# Altium schematic sheet MPU.SchDoc
size A3; SheetNumber: 8; SheetTotal: 14
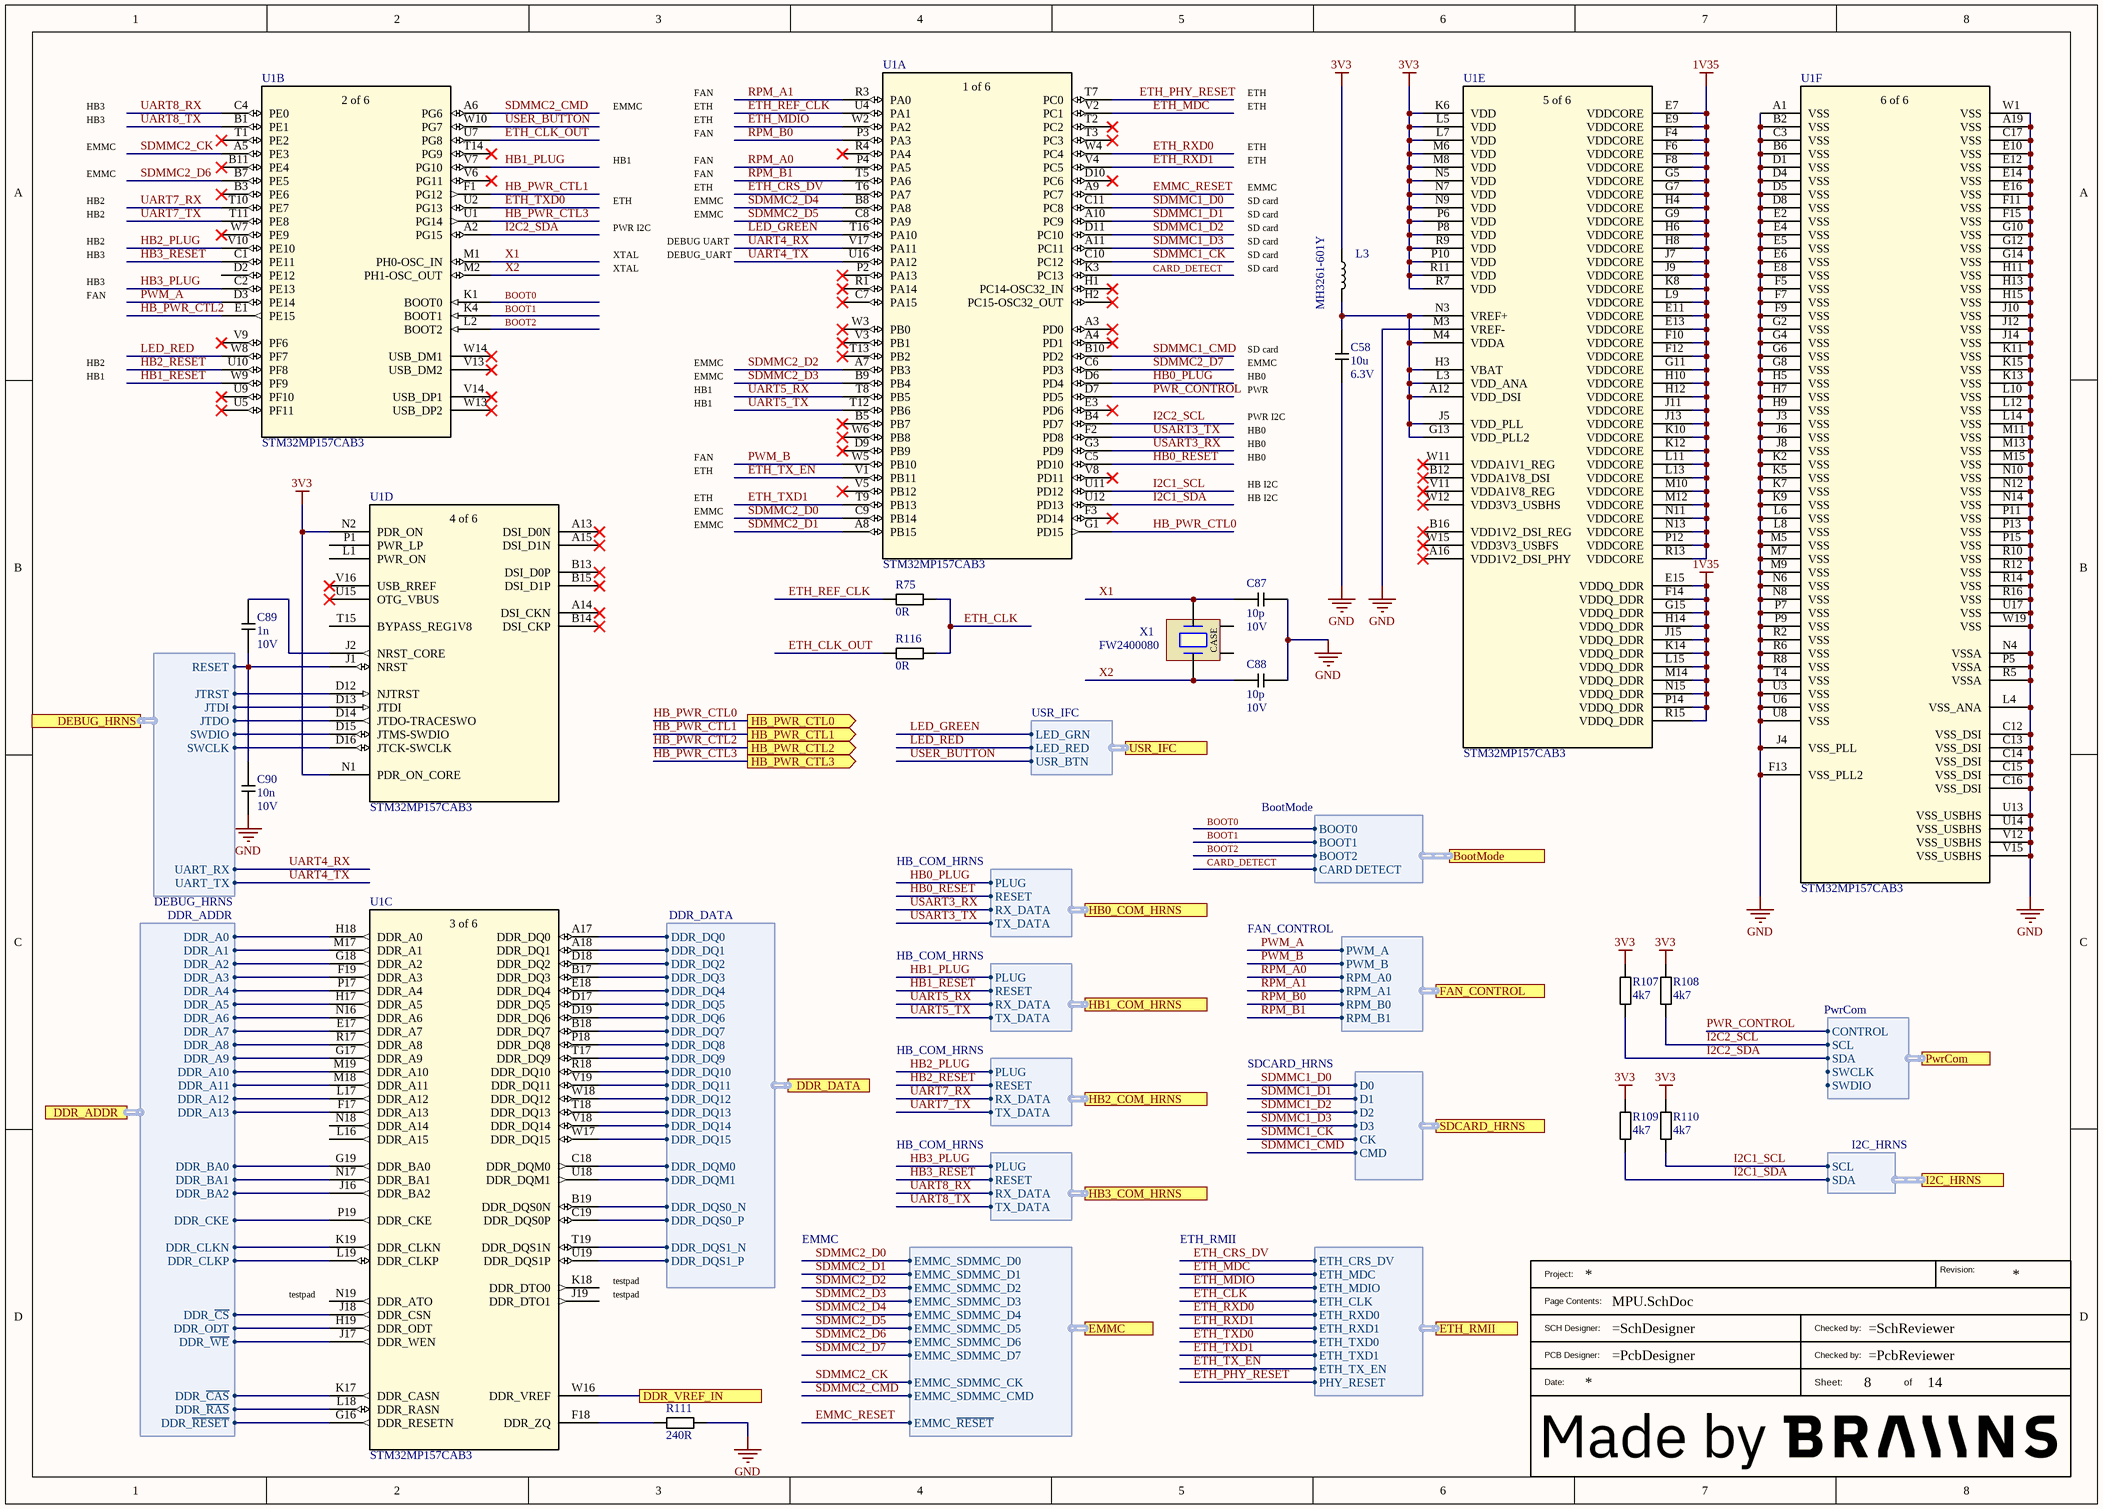
[diagram p0: MPU.SchDoc]

## Parts
?  BraiinsTitleBlockWithLogo  (value not drawn)  (graphical)
C58  Voltage_Rating: 6.3V  [CAP0603]  (hidden comment: 10u)
C87  Voltage_Rating: 10V  [CAP0402]  (hidden comment: 10p)
C88  Voltage_Rating: 10V  [CAP0402]  (hidden comment: 10p)
C89  Voltage_Rating: 10V  [CAP0402]  (hidden comment: 1n)
C90  Voltage_Rating: 10V  [CAP0402]  (hidden comment: 10n)
L3  MH3261-601Y  [RES1206]
R75  0R  [RES0402]
R107  4k7  [RES0402]
R108  4k7  [RES0402]
R109  4k7  [RES0402]
R110  4k7  [RES0402]
R111  240R  [RES0402]
R116  0R  [RES0402]
U1  STM32MP157CAB3  [LFBGA354_16X16]  (parts A,B,C,D,E,F of 6)
X1  FW2400080  [XTAL_4PIN_20X16]

## Ports
BootMode (harness BootMode), DDR_ADDR (harness DDR_ADDR), DDR_DATA (harness DDR_DATA), DDR_VREF_IN, DEBUG_HRNS (harness DEBUG_HRNS), EMMC (harness EMMC), ETH_RMII (harness ETH_RMII), FAN_CONTROL (harness FAN_CONTROL), HB0_COM_HRNS (harness HB_COM_HRNS), HB1_COM_HRNS (harness HB_COM_HRNS), HB2_COM_HRNS (harness HB_COM_HRNS), HB3_COM_HRNS (harness HB_COM_HRNS), HB_PWR_CTL0 (out), HB_PWR_CTL1 (out), HB_PWR_CTL2 (out), HB_PWR_CTL3 (out), I2C_HRNS (harness I2C_HRNS), PwrCom (harness PwrCom), SDCARD_HRNS (harness SDCARD_HRNS), USR_IFC (harness USR_IFC)

## Harnesses
DDR_DATA: DDR_DQ0, DDR_DQ1, DDR_DQ10, DDR_DQ11, DDR_DQ12, DDR_DQ13, DDR_DQ14, DDR_DQ15, DDR_DQ2, DDR_DQ3, DDR_DQ4, DDR_DQ5, DDR_DQ6, DDR_DQ7, DDR_DQ8, DDR_DQ9, DDR_DQM0, DDR_DQM1, DDR_DQS0_N, DDR_DQS0_P, DDR_DQS1_N, DDR_DQS1_P
DDR_ADDR: DDR_A0, DDR_A1, DDR_A10, DDR_A11, DDR_A12, DDR_A13, DDR_A2, DDR_A3, DDR_A4, DDR_A5, DDR_A6, DDR_A7, DDR_A8, DDR_A9, DDR_BA0, DDR_BA1, DDR_BA2, DDR_CKE, DDR_CLKN, DDR_CLKP, DDR_~{CAS}, DDR_~{CS}, DDR_ODT, DDR_~{RAS}, DDR_~{RESET}, DDR_~{WE}
DEBUG_HRNS: JTDI, JTDO, JTRST, RESET, SWCLK, SWDIO, UART_TX, UART_RX
SDCARD_HRNS: CK, CMD, D0, D1, D2, D3
EMMC: EMMC_~{RESET}, EMMC_SDMMC_CK, EMMC_SDMMC_CMD, EMMC_SDMMC_D0, EMMC_SDMMC_D1, EMMC_SDMMC_D2, EMMC_SDMMC_D3, EMMC_SDMMC_D4, EMMC_SDMMC_D5, EMMC_SDMMC_D6, EMMC_SDMMC_D7
ETH_RMII: ETH_CRS_DV, ETH_MDC, ETH_MDIO, ETH_CLK, ETH_RXD0, ETH_RXD1, ETH_TXD0, ETH_TXD1, ETH_TX_EN, PHY_RESET
HB_COM_HRNS: PLUG, RESET, RX_DATA, TX_DATA
I2C_HRNS: SCL, SDA
PwrCom: CONTROL, SCL, SDA, SWCLK, SWDIO
FAN_CONTROL: PWM_A, PWM_B, RPM_A0, RPM_A1, RPM_B0, RPM_B1
BootMode: BOOT0, BOOT1, BOOT2, CARD DETECT
USR_IFC: LED_GRN, LED_RED, USR_BTN

## Nets
1V35: U1.E7(VDDCORE) U1.E9(VDDCORE) U1.E11(VDDCORE) U1.E13(VDDCORE) U1.E15(VDDQ_DDR) U1.F4(VDDCORE) U1.F6(VDDCORE) U1.F8(VDDCORE) U1.F10(VDDCORE) U1.F12(VDDCORE) U1.F14(VDDQ_DDR) U1.G5(VDDCORE) U1.G7(VDDCORE) U1.G9(VDDCORE) U1.G11(VDDCORE) U1.G15(VDDQ_DDR) U1.H4(VDDCORE) U1.H6(VDDCORE) U1.H8(VDDCORE) U1.H10(VDDCORE) U1.H12(VDDCORE) U1.H14(VDDQ_DDR) U1.J7(VDDCORE) U1.J9(VDDCORE) U1.J11(VDDCORE) U1.J13(VDDCORE) U1.J15(VDDQ_DDR) U1.K8(VDDCORE) U1.K10(VDDCORE) U1.K12(VDDCORE) U1.K14(VDDQ_DDR) U1.L9(VDDCORE) U1.L11(VDDCORE) U1.L13(VDDCORE) U1.L15(VDDQ_DDR) U1.M10(VDDCORE) U1.M12(VDDCORE) U1.M14(VDDQ_DDR) U1.N11(VDDCORE) U1.N13(VDDCORE) U1.N15(VDDQ_DDR) U1.P12(VDDCORE) U1.P14(VDDQ_DDR) U1.R13(VDDCORE) U1.R15(VDDQ_DDR)
3V3: L3.1 R107.1 R108.1 R109.1 R110.1 U1.K6(VDD) U1.L5(VDD) U1.L7(VDD) U1.M6(VDD) U1.M8(VDD) U1.N1(PDR_ON_CORE) U1.N2(PDR_ON) U1.N5(VDD) U1.N7(VDD) U1.N9(VDD) U1.P6(VDD) U1.P8(VDD) U1.P10(VDD) U1.R7(VDD) U1.R9(VDD) U1.R11(VDD)
GND: C58.2 C87.1 C88.2 C90.2 R111.2 U1.A1(VSS) U1.A19(VSS) U1.B2(VSS) U1.B6(VSS) U1.C3(VSS) U1.C12(VSS_DSI) U1.C13(VSS_DSI) U1.C14(VSS_DSI) U1.C15(VSS_DSI) U1.C16(VSS_DSI) U1.C17(VSS) U1.D1(VSS) U1.D4(VSS) U1.D5(VSS) U1.D8(VSS) U1.E2(VSS) U1.E4(VSS) U1.E5(VSS) U1.E6(VSS) U1.E8(VSS) U1.E10(VSS) U1.E12(VSS) U1.E14(VSS) U1.E16(VSS) U1.F5(VSS) U1.F7(VSS) U1.F9(VSS) U1.F11(VSS) U1.F13(VSS_PLL2) U1.F15(VSS) U1.G2(VSS) U1.G4(VSS) U1.G6(VSS) U1.G8(VSS) U1.G10(VSS) U1.G12(VSS) U1.G14(VSS) U1.H5(VSS) U1.H7(VSS) U1.H9(VSS) U1.H11(VSS) U1.H13(VSS) U1.H15(VSS) U1.J3(VSS) U1.J4(VSS_PLL) U1.J6(VSS) U1.J8(VSS) U1.J10(VSS) U1.J12(VSS) U1.J14(VSS) U1.K2(VSS) U1.K5(VSS) U1.K7(VSS) U1.K9(VSS) U1.K11(VSS) U1.K13(VSS) U1.K15(VSS) U1.L4(VSS_ANA) U1.L6(VSS) U1.L8(VSS) U1.L10(VSS) U1.L12(VSS) U1.L14(VSS) U1.M3(VREF-) U1.M5(VSS) U1.M7(VSS) U1.M9(VSS) U1.M11(VSS) U1.M13(VSS) U1.M15(VSS) U1.N4(VSSA) U1.N6(VSS) U1.N8(VSS) U1.N10(VSS) U1.N12(VSS) U1.N14(VSS) U1.P5(VSSA) U1.P7(VSS) U1.P9(VSS) U1.P11(VSS) U1.P13(VSS) U1.P15(VSS) U1.R2(VSS) U1.R5(VSSA) U1.R6(VSS) U1.R8(VSS) U1.R10(VSS) U1.R12(VSS) U1.R14(VSS) U1.R16(VSS) U1.T4(VSS) U1.U3(VSS) U1.U6(VSS) U1.U8(VSS) U1.U13(VSS_USBHS) U1.U14(VSS_USBHS) U1.U17(VSS) U1.V12(VSS_USBHS) U1.V15(VSS_USBHS) U1.W1(VSS) U1.W19(VSS)
BOOT0: U1.K1(BOOT0) ; port BootMode.BOOT0
BOOT1: U1.K4(BOOT1) ; port BootMode.BOOT1
BOOT2: U1.L2(BOOT2) ; port BootMode.BOOT2
CARD_DETECT: U1.K3(PC13) ; port BootMode.CARD DETECT
DDR_VREF_IN: U1.W16(DDR_VREF) ; port DDR_VREF_IN
EMMC_RESET: U1.A9(PC7) ; port EMMC.EMMC_~{RESET}
ETH_CLK: R75.2 R116.2 ; port ETH_RMII.ETH_CLK
ETH_CLK_OUT: R116.1 U1.U7(PG8)
ETH_CRS_DV: U1.T6(PA7) ; port ETH_RMII.ETH_CRS_DV
ETH_MDC: U1.V2(PC1) ; port ETH_RMII.ETH_MDC
ETH_MDIO: U1.W2(PA2) ; port ETH_RMII.ETH_MDIO
ETH_PHY_RESET: U1.T7(PC0) ; port ETH_RMII.PHY_RESET
ETH_REF_CLK: R75.1 U1.U4(PA1)
ETH_RXD0: U1.W4(PC4) ; port ETH_RMII.ETH_RXD0
ETH_RXD1: U1.V4(PC5) ; port ETH_RMII.ETH_RXD1
ETH_TX_EN: U1.V1(PB11) ; port ETH_RMII.ETH_TX_EN
ETH_TXD0: U1.U2(PG13) ; port ETH_RMII.ETH_TXD0
ETH_TXD1: U1.T9(PB13) ; port ETH_RMII.ETH_TXD1
HB0_PLUG: U1.D6(PD4) ; port HB0_COM_HRNS.PLUG
HB0_RESET: U1.C5(PD10) ; port HB0_COM_HRNS.RESET
HB1_PLUG: U1.V7(PG10) ; port HB1_COM_HRNS.PLUG
HB1_RESET: U1.W9(PF9) ; port HB1_COM_HRNS.RESET
HB2_PLUG: U1.V10(PE10) ; port HB2_COM_HRNS.PLUG
HB2_RESET: U1.U10(PF8) ; port HB2_COM_HRNS.RESET
HB3_PLUG: U1.C2(PE13) ; port HB3_COM_HRNS.PLUG
HB3_RESET: U1.C1(PE11) ; port HB3_COM_HRNS.RESET
HB_PWR_CTL0: U1.G1(PD15) ; port HB_PWR_CTL0
HB_PWR_CTL1: U1.F1(PG12) ; port HB_PWR_CTL1
HB_PWR_CTL2: U1.E1(PE15) ; port HB_PWR_CTL2
HB_PWR_CTL3: U1.U1(PG14) ; port HB_PWR_CTL3
I2C1_SCL: R110.2 U1.U11(PD12) ; port I2C_HRNS.SCL
I2C1_SDA: R109.2 U1.U12(PD13) ; port I2C_HRNS.SDA
I2C2_SCL: R108.2 U1.B4(PD7) ; port PwrCom.SCL
I2C2_SDA: R107.2 U1.A2(PG15) ; port PwrCom.SDA
LED_GREEN: U1.T16(PA10) ; port USR_IFC.LED_GRN
LED_RED: U1.W8(PF7) ; port USR_IFC.LED_RED
PWM_A: U1.D3(PE14) ; port FAN_CONTROL.PWM_A
PWM_B: U1.W5(PB10) ; port FAN_CONTROL.PWM_B
PWR_CONTROL: U1.D7(PD5) ; port PwrCom.CONTROL
RPM_A0: U1.P4(PA5) ; port FAN_CONTROL.RPM_A0
RPM_A1: U1.R3(PA0) ; port FAN_CONTROL.RPM_A1
RPM_B0: U1.P3(PA3) ; port FAN_CONTROL.RPM_B0
RPM_B1: U1.T5(PA6) ; port FAN_CONTROL.RPM_B1
SDMMC1_CK: U1.C10(PC12) ; port SDCARD_HRNS.CK
SDMMC1_CMD: U1.B10(PD2) ; port SDCARD_HRNS.CMD
SDMMC1_D0: U1.C11(PC8) ; port SDCARD_HRNS.D0
SDMMC1_D1: U1.A10(PC9) ; port SDCARD_HRNS.D1
SDMMC1_D2: U1.D11(PC10) ; port SDCARD_HRNS.D2
SDMMC1_D3: U1.A11(PC11) ; port SDCARD_HRNS.D3
SDMMC2_CK: U1.A5(PE3) ; port EMMC.EMMC_SDMMC_CK
SDMMC2_CMD: U1.A6(PG6) ; port EMMC.EMMC_SDMMC_CMD
SDMMC2_D0: U1.C9(PB14) ; port EMMC.EMMC_SDMMC_D0
SDMMC2_D1: U1.A8(PB15) ; port EMMC.EMMC_SDMMC_D1
SDMMC2_D2: U1.A7(PB3) ; port EMMC.EMMC_SDMMC_D2
SDMMC2_D3: U1.B9(PB4) ; port EMMC.EMMC_SDMMC_D3
SDMMC2_D4: U1.B8(PA8) ; port EMMC.EMMC_SDMMC_D4
SDMMC2_D5: U1.C8(PA9) ; port EMMC.EMMC_SDMMC_D5
SDMMC2_D6: U1.B7(PE5) ; port EMMC.EMMC_SDMMC_D6
SDMMC2_D7: U1.C6(PD3) ; port EMMC.EMMC_SDMMC_D7
UART4_RX: U1.V17(PA11) ; port DEBUG_HRNS.UART_RX
UART4_TX: U1.U16(PA12) ; port DEBUG_HRNS.UART_TX
UART5_RX: U1.T8(PB5) ; port HB1_COM_HRNS.RX_DATA
UART5_TX: U1.T12(PB6) ; port HB1_COM_HRNS.TX_DATA
UART7_RX: U1.T10(PE7) ; port HB2_COM_HRNS.RX_DATA
UART7_TX: U1.T11(PE8) ; port HB2_COM_HRNS.TX_DATA
UART8_RX: U1.C4(PE0) ; port HB3_COM_HRNS.RX_DATA
UART8_TX: U1.B1(PE1) ; port HB3_COM_HRNS.TX_DATA
USART3_RX: U1.G3(PD9) ; port HB0_COM_HRNS.RX_DATA
USART3_TX: U1.F2(PD8) ; port HB0_COM_HRNS.TX_DATA
USER_BUTTON: U1.W10(PG7) ; port USR_IFC.USR_BTN
X1: C87.2 U1.M1(PH0-OSC_IN) X1.3(X2)
X2: C88.1 U1.M2(PH1-OSC_OUT) X1.1(X1)
NetC58_1: C58.1 L3.2 U1.A12(VDD_DSI) U1.G13(VDD_PLL2) U1.H3(VBAT) U1.J5(VDD_PLL) U1.L3(VDD_ANA) U1.M4(VDDA) U1.N3(VREF+)
NetC89_1: C89.1 U1.J2(NRST_CORE)
NetC89_2: C89.2 C90.1 U1.J1(NRST) ; port DEBUG_HRNS.RESET
NetR111_1: R111.1 U1.F18(DDR_ZQ)
NetU1_A17: U1.A17(DDR_DQ0) ; port DDR_DATA.DDR_DQ0
NetU1_A18: U1.A18(DDR_DQ1) ; port DDR_DATA.DDR_DQ1
NetU1_B17: U1.B17(DDR_DQ3) ; port DDR_DATA.DDR_DQ3
NetU1_B18: U1.B18(DDR_DQ7) ; port DDR_DATA.DDR_DQ7
NetU1_B19: U1.B19(DDR_DQS0N) ; port DDR_DATA.DDR_DQS0_N
NetU1_C18: U1.C18(DDR_DQM0) ; port DDR_DATA.DDR_DQM0
NetU1_C19: U1.C19(DDR_DQS0P) ; port DDR_DATA.DDR_DQS0_P
NetU1_D12: U1.D12(NJTRST) ; port DEBUG_HRNS.JTRST
NetU1_D13: U1.D13(JTDI) ; port DEBUG_HRNS.JTDI
NetU1_D14: U1.D14(JTDO-TRACESWO) ; port DEBUG_HRNS.JTDO
NetU1_D15: U1.D15(JTMS-SWDIO) ; port DEBUG_HRNS.SWDIO
NetU1_D16: U1.D16(JTCK-SWCLK) ; port DEBUG_HRNS.SWCLK
NetU1_D17: U1.D17(DDR_DQ5) ; port DDR_DATA.DDR_DQ5
NetU1_D18: U1.D18(DDR_DQ2) ; port DDR_DATA.DDR_DQ2
NetU1_D19: U1.D19(DDR_DQ6) ; port DDR_DATA.DDR_DQ6
NetU1_E17: U1.E17(DDR_A7) ; port DDR_ADDR.DDR_A7
NetU1_E18: U1.E18(DDR_DQ4) ; port DDR_DATA.DDR_DQ4
NetU1_F17: U1.F17(DDR_A13) ; port DDR_ADDR.DDR_A13
NetU1_F19: U1.F19(DDR_A3) ; port DDR_ADDR.DDR_A3
NetU1_G16: U1.G16(DDR_RESETN) ; port DDR_ADDR.DDR_~{RESET}
NetU1_G17: U1.G17(DDR_A9) ; port DDR_ADDR.DDR_A9
NetU1_G18: U1.G18(DDR_A2) ; port DDR_ADDR.DDR_A2
NetU1_G19: U1.G19(DDR_BA0) ; port DDR_ADDR.DDR_BA0
NetU1_H17: U1.H17(DDR_A5) ; port DDR_ADDR.DDR_A5
NetU1_H18: U1.H18(DDR_A0) ; port DDR_ADDR.DDR_A0
NetU1_H19: U1.H19(DDR_ODT) ; port DDR_ADDR.DDR_ODT
NetU1_J16: U1.J16(DDR_BA2) ; port DDR_ADDR.DDR_BA2
NetU1_J17: U1.J17(DDR_WEN) ; port DDR_ADDR.DDR_~{WE}
NetU1_J18: U1.J18(DDR_CSN) ; port DDR_ADDR.DDR_~{CS}
NetU1_K17: U1.K17(DDR_CASN) ; port DDR_ADDR.DDR_~{CAS}
NetU1_K19: U1.K19(DDR_CLKN) ; port DDR_ADDR.DDR_CLKN
NetU1_L17: U1.L17(DDR_A12) ; port DDR_ADDR.DDR_A12
NetU1_L18: U1.L18(DDR_RASN) ; port DDR_ADDR.DDR_~{RAS}
NetU1_L19: U1.L19(DDR_CLKP) ; port DDR_ADDR.DDR_CLKP
NetU1_M17: U1.M17(DDR_A1) ; port DDR_ADDR.DDR_A1
NetU1_M18: U1.M18(DDR_A11) ; port DDR_ADDR.DDR_A11
NetU1_M19: U1.M19(DDR_A10) ; port DDR_ADDR.DDR_A10
NetU1_N16: U1.N16(DDR_A6) ; port DDR_ADDR.DDR_A6
NetU1_N17: U1.N17(DDR_BA1) ; port DDR_ADDR.DDR_BA1
NetU1_P17: U1.P17(DDR_A4) ; port DDR_ADDR.DDR_A4
NetU1_P18: U1.P18(DDR_DQ8) ; port DDR_DATA.DDR_DQ8
NetU1_P19: U1.P19(DDR_CKE) ; port DDR_ADDR.DDR_CKE
NetU1_R17: U1.R17(DDR_A8) ; port DDR_ADDR.DDR_A8
NetU1_R18: U1.R18(DDR_DQ10) ; port DDR_DATA.DDR_DQ10
NetU1_T17: U1.T17(DDR_DQ9) ; port DDR_DATA.DDR_DQ9
NetU1_T18: U1.T18(DDR_DQ13) ; port DDR_DATA.DDR_DQ13
NetU1_T19: U1.T19(DDR_DQS1N) ; port DDR_DATA.DDR_DQS1_N
NetU1_U18: U1.U18(DDR_DQM1) ; port DDR_DATA.DDR_DQM1
NetU1_U19: U1.U19(DDR_DQS1P) ; port DDR_DATA.DDR_DQS1_P
NetU1_V18: U1.V18(DDR_DQ14) ; port DDR_DATA.DDR_DQ14
NetU1_V19: U1.V19(DDR_DQ11) ; port DDR_DATA.DDR_DQ11
NetU1_W17: U1.W17(DDR_DQ15) ; port DDR_DATA.DDR_DQ15
NetU1_W18: U1.W18(DDR_DQ12) ; port DDR_DATA.DDR_DQ12

Not connected (* = marked no-connect by the designer): U1 A3(PD0)* A4(PD1)* A13(DSI_D0N)* A14(DSI_CKN)* A15(DSI_D1N)* A16(VDD1V2_DSI_PHY)* B3(PE6)* B5(PB7)* B11(PE4)* B12(VDDA1V8_DSI)* B13(DSI_D0P)* B14(DSI_CKP)* B15(DSI_D1P)* B16(VDD1V2_DSI_REG)* C7(PA15)* D2(PE12) D9(PB9)* D10(PC6)* E3(PD6)* F3(PD14)* H1(PC14-OSC32_IN)* H2(PC15-OSC32_OUT)* J19(DDR_DTO1) K18(DDR_DTO0) L1(PWR_ON) L16(DDR_A15) N18(DDR_A14) N19(DDR_ATO) P1(PWR_LP) P2(PA13)* R1(PA14)* R4(PA4)* T1(PE2)* T2(PC2)* T3(PC3)* T13(PB2)* T14(PG9)* T15(BYPASS_REG1V8) U5(PF11)* U9(PF10)* U15(OTG_VBUS)* V3(PB1)* V5(PB12)* V6(PG11)* V8(PD11)* V9(PF6)* V11(VDDA1V8_REG)* V13(USB_DM2)* V14(USB_DP1)* V16(USB_RREF)* W3(PB0)* W6(PB8)* W7(PE9)* W11(VDDA1V1_REG)* W12(VDD3V3_USBHS)* W13(USB_DP2)* W14(USB_DM1)* W15(VDD3V3_USBFS)*; X1 2(CASE) 4(CASE)

## Notes on the sheet
- HB3
- EMMC
- ETH
- FAN
- HB1
- HB2
- PWR I2C
- DEBUG UART
- SD card
- XTAL
- DEBUG_UART
- HB0
- PWR
- HB I2C
- (near U1) testpad
- testpad
- (in symbol 30145, part A) 1 of 6
- (in symbol 30145, part B) 2 of 6
- (in symbol 30145, part C) 3 of 6
- (in symbol 30145, part D) 4 of 6
- (in symbol 30145, part E) 5 of 6
- (in symbol 30145, part F) 6 of 6
- (in symbol BraiinsTitleBlockWithLogo) Revision:; Project:; Page Contents:; SCH Designer:; Checked by:; PCB Designer:; Date:; Sheet:; of

## Library data of the parts
C58 = 30139: CAP CER 10u 10% 6.3V 0603 X5R; Part_Type: Capacitor; Part_Status: New; ID: 30139; Updated By: janjuranek; Sorted_Value: 10; Value: 10u; Sub_Type: CER; Manufacturer Part Description: CAP CER 10u 10% 6.3V 0603 X5R; Package_Case: 0603; RoHS: Yes; Dielectric: X5R; Tolerance: 10%; Created By: janjuranek; Created_Date: 2023-04-12 21:40:22; Updated_Date: 2023-04-12 21:42:06; ComponentLink1Description: Datasheet; ComponentLink2Description: Supplier Part Details
C87 C88 = 30167: CAP CER 10p 10% 10V X7R 0402; Part_Type: Capacitor; Part_Status: New; ID: 30167; Updated By: janjuranek; Sorted_Value: 10; Value: 10p; Sub_Type: CER; Manufacturer Part Description: CAP CER 10p 10% 10V X7R 0402; Package_Case: 0402; RoHS: Yes; Dielectric: X7R; Tolerance: 10%; Created By: janjuranek; Created_Date: 2023-05-01 22:54:33; Updated_Date: 2023-05-01 22:55:10; ComponentLink1Description: Datasheet; ComponentLink2Description: Supplier Part Details
C89 = 30168: CAP CER 1n 10% 10V X7R 0402; Part_Type: Capacitor; Part_Status: New; ID: 30168; Updated By: janjuranek; Sorted_Value: 1; Value: 1n; Sub_Type: CER; Manufacturer Part Description: CAP CER 1n 10% 10V X7R 0402; Package_Case: 0402; RoHS: Yes; Dielectric: X7R; Tolerance: 10%; Created By: janjuranek; Created_Date: 2023-05-02 09:44:44; Updated_Date: 2023-05-02 09:45:52; ComponentLink1Description: Datasheet; ComponentLink2Description: Supplier Part Details
C90 = 30169: CAP CER 10n 10% 10V X7R 0402; Part_Type: Capacitor; Part_Status: New; ID: 30169; Updated By: janjuranek; Sorted_Value: 10; Value: 10n; Sub_Type: CER; Manufacturer Part Description: CAP CER 10n 10% 10V X7R 0402; Package_Case: 0402; RoHS: Yes; Dielectric: X7R; Tolerance: 10%; Created By: janjuranek; Created_Date: 2023-05-02 09:45:11; Updated_Date: 2023-05-02 09:47:54; ComponentLink1Description: Datasheet; ComponentLink2Description: Supplier Part Details
L3 = 30184: FERRITE BEAD 600 OHM 1206 1LN; Part_Type: Filter; Manufacturer: Bourns Inc.; Part_Status: New; ID: 30184; Current_Rating: 2A; Updated By: janjuranek; Value: MH3261-601Y; Manufacturer Part Number: MH3261-601Y; Manufacturer Part Description: FERRITE BEAD 600 OHM 1206 1LN; Supplier 1: Digi-Key; Supplier Part Number 1: MH3261-601YTR-ND; Package_Case: 1206; RoHS: Yes; Temperature Range: -55C to +125C; Created By: janjuranek; Created_Date: 2023-05-23 03:45:05; Updated_Date: 2023-05-23 03:45:38; ComponentLink1Description: Datasheet; ComponentLink2Description: Supplier Part Details; ComponentLink2URL: https://www.digikey.com/products/en?keywords=MH3261-601Y
R75 R116 = 30178: RES 0R Ohm 1% 0402; Part_Status: New; ID: 30178; Updated By: janjuranek; Sorted_Value: 0; Value: 0R; Part_Type: Resistor; Manufacturer Part Description: RES 0R Ohm 1% 0402; Package_Case: 0402; RoHS: Yes; Tolerance: 1%; Created By: janjuranek; Created_Date: 2023-05-15 08:47:05; Updated_Date: 2023-05-15 08:47:18; ComponentLink1Description: Datasheet; ComponentLink2Description: Supplier Part Details
R107-R110 = 30073: RES 4k7 Ohm 1% 0402; Part_Status: New; ID: 30073; Updated By: Jan; Sorted_Value: 4; Value: 4k7; Part_Type: Resistor; Manufacturer Part Description: RES 4k7 Ohm 1% 0402; Package_Case: 0402; RoHS: Yes; Temperature Range: -40 to +150C; Tolerance: 1%; Created By: Jan; Created_Date: 2023-03-02 13:15:12; Updated_Date: 2023-03-02 13:15:46; ComponentLink1Description: Datasheet; ComponentLink2Description: Supplier Part Details
R111 = 30141: RES 240R Ohm 1% 0402; Part_Status: New; ID: 30141; Updated By: janjuranek; Sorted_Value: 240; Value: 240R; Part_Type: Resistor; Manufacturer Part Description: RES 240R Ohm 1% 0402; Package_Case: 0402; RoHS: Yes; Tolerance: 1%; Created By: janjuranek; Created_Date: 2023-04-13 00:40:15; Updated_Date: 2023-04-13 00:40:34; ComponentLink1Description: Datasheet; ComponentLink2Description: Supplier Part Details
U1 = 30145: IC MPU STM32MP1 650MHZ 354LFBGA; Mfr_Name: STMicroelectronics; Part_Status: New; ID: 30145; Updated By: janjuranek; RefDes: RefDes; TYPE: IC; Value: STM32MP157CAB3; Part_Type: IC; Manufacturer Part Number: STM32MP157CAB3; Manufacturer: STMicroelectronics; Manufacturer Part Description: IC MPU STM32MP1 650MHZ 354LFBGA; Supplier 1: Digi-Key; Supplier Part Number 1: STM32MP157CAB3-ND; Package_Case: 354-LFBGA; RoHS: Yes; Temperature Range: -40C to +125C (TA); Created By: janjuranek; Created_Date: 2023-04-18 09:47:39; Updated_Date: 2023-04-18 09:49:15; ComponentLink1Description: Datasheet; ComponentLink2Description: Supplier Part Details; ComponentLink2URL: https://www.digikey.com/products/en?keywords=STM32MP157CAB3
X1 = 30166: Crystal Ceramic 24MHz; Manufacturer: Diodes Incorporated; Part_Status: New; ID: 30166; Tolerance: ±20ppm; Updated By: janjuranek; Value: FW2400080; Part_Type: Crystal; Manufacturer Part Number: FW2400080; Manufacturer Part Description: Crystal Ceramic 24MHz; Supplier 1: Digi-Key; Supplier Part Number 1: 31-FW2400080-ND; RoHS: Yes; Temperature Range: -40C to +85C; Created By: janjuranek; Created_Date: 2023-05-01 22:52:25; Updated_Date: 2023-05-02 16:29:25; ComponentLink1Description: Datasheet; ComponentLink2Description: Supplier Part Details; ComponentLink2URL: https://www.digikey.com/products/en?keywords=FW2400080